# Altium project PCB_Project_1.PrjPcb
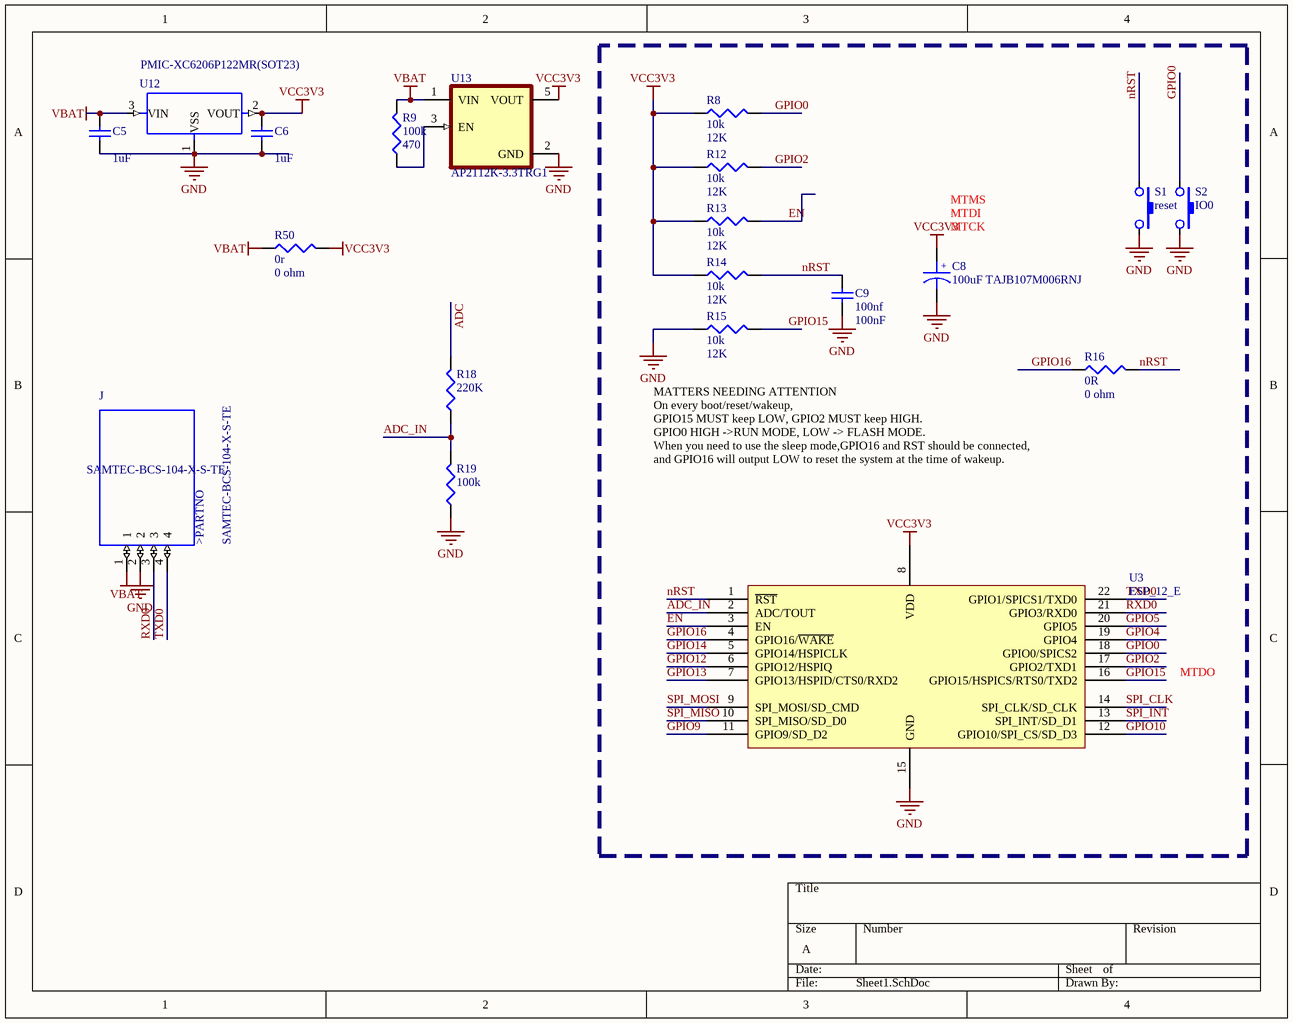
[diagram p0: Sheet1.SchDoc]
2 sheets, 37 parts. Net scope: global (net labels, ports and power ports of the same name join across sheets).
Board files: PCB1.PcbDoc, PCB2.PcbDoc
Sheets:
  Sheet1.SchDoc
  Sheet2.SchDoc

## Sheet Sheet1.SchDoc
size A

### Parts
(Parts that share a designator on the sheet are numbered #1, #2 ... from top to bottom, then left to right.)
C5  value 1uF  [1608[0603]]
C6  value 1uF  [1608[0603]]
C8  100uF TAJB107M006RNJ  [SMT_C_Tantalum_B]
C9  100nf  [1608[0603]]
J  SAMTEC-BCS-104-X-S-TE  [SAMTEC-BCS-104-X-S-TE]
R8  10k  value 12K  [J1-0603]
R9  100k  value 470  [J1-0603]
R12  10k  value 12K  [J1-0603]
R13  10k  value 12K  [J1-0603]
R14  10k  value 12K  [J1-0603]
R15  10k  value 12K  [J1-0603]
R16  0R  value 0 ohm  [J1-0603]
R18  220K  [J1-0603]
R19#1  100k  [J1-0603]
R50  0r  value 0 ohm  [J1-0603]
S1  reset  [SMT_SW_PTS_820]
S2  IO0  [SMT_SW_PTS_820]
U3  ESP_12_E  [ESP_12_E_L]
U12  PMIC-XC6206P122MR(SOT23)  [SOT-23]
U13  AP2112K-3.3TRG1  [SOT95P285X140-5N]

### Nets
GND: C5.1 C6.1 C8.2 C9.1 J.2 R15.1 R19#1.1 S1.2 S2.2 U3.15(GND) U12.1(VSS) U13.2(GND)
VBAT: C5.2 J.1 R9.2 R50.1 U12.3(VIN) U13.1(VIN)
VCC3V3: C6.2 C8.1 R8.1 R12.1 R13.1 R14.1 R50.2 U3.8(VDD) U12.2(VOUT) U13.5(VOUT)
ADC: R18.2
ADC_IN: R18.1 R19#1.2 U3.2(ADC/TOUT)
EN: R13.2 U3.3(EN)
GPIO0: R8.2 S2.1 U3.18(GPIO0/SPICS2)
GPIO2: R12.2 U3.17(GPIO2/TXD1)
GPIO4: U3.19(GPIO4)
GPIO5: U3.20(GPIO5)
GPIO9: U3.11(GPIO9/SD_D2)
GPIO10: U3.12(GPIO10/SPI_CS/SD_D3)
GPIO12: U3.6(GPIO12/HSPIQ)
GPIO13: U3.7(GPIO13/HSPID/CTS0/RXD2)
GPIO14: U3.5(GPIO14/HSPICLK)
GPIO15: R15.2 U3.16(GPIO15/HSPICS/RTS0/TXD2)
GPIO16: R16.1 U3.4(GPIO16/~{WAKE})
nRST: C9.2 R14.2 R16.2 S1.1 U3.1(~{RST})
RXD0: J.3 U3.21(GPIO3/RXD0)
SPI_CLK: U3.14(SPI_CLK/SD_CLK)
SPI_INT: U3.13(SPI_INT/SD_D1)
SPI_MISO: U3.10(SPI_MISO/SD_D0)
SPI_MOSI: U3.9(SPI_MOSI/SD_CMD)
TXD0: J.4 U3.22(GPIO1/SPICS1/TXD0)
NetR9_1: R9.1 U13.3(EN)

### Notes on the sheet
- (near C8) MTCK
- (near C8) MTDI
- MTMS
- (near R16) MATTERS NEEDING ATTENTION
  On every boot/reset/wakeup,
  GPIO15 MUST keep LOW, GPIO2 MUST keep HIGH.
  GPIO0 HIGH ->RUN MODE, LOW -> FLASH MODE.
  When you need to use the sleep mode,GPIO16 and RST should be connected,
  and GPIO16 will output LOW to reset the system at the time of wakeup.
- MTDO
- (in symbol SAMTEC-BCS-104-X-S-TE) >PARTNO
- (in symbol SMT_C_Tantalum_B) +

### Library data of the parts
C5 C6 C9 = Cap Semi: Capacitor (Semiconductor SIM Model); Published: 8-Jun-2000; LatestRevisionDate: 29-May-2009; LatestRevisionNote: IPC-7351 Footprint Added.; PackageReference: C1206; Publisher: Altium Limited; PackageDescription: Chip Capacitor
  C9: Value: 100nF
C8 = SMT_C_Tantalum_B: Capacitor, SM Tantalum; Body 3.5 x 2.8 mm (LxW typ)
J = SAMTEC-BCS-104-X-S-TE: 4 Position Receptacle Connector Through Hole; MP: BCS-104-LM-S-TE; MF: Samtec; Price: None; Value: *; Package: None; SnapEDA_Link: https://www.snapeda.com/parts/BCS-104-LM-S-TE/Samtec/view-part/3331485/?ref=snap; Availability: Unavailable
R8 R9 R12-R16 R18 R19#1 R50 = Res3: Resistor; Published: 8-Jun-2000; LatestRevisionDate: 29-May-2009; LatestRevisionNote: IPC-7351 Footprint Added.; PackageReference: J1-0603; Publisher: Altium Limited; PackageDescription: Chip Resistor
S1 S2 = SMT_SW_PTS_820: SMT Tactile ‎Switch PTS 820 Series
U3 = ESP_12_E: ESP-12 Wi-Fi Module by AI-Thinker; IC: ESP8266-EX; Vendor: Ai-thinker
U12 = PMIC-XC6206P122MR(SOT23): Linear Voltage Regulator IC Output; MF: Torex; Value: *; Package: None; Price: None; MP: XC6206P122MR; Availability: Unavailable; SnapEDA_Link: https://www.snapeda.com/parts/XC6206P122MR/Torex/view-part/105791/?ref=snap
U13 = AP2112K-3.3TRG1: Linear Voltage Regulator IC 1 Output 600mA SOT-25; MF: Diodes Inc.; Digi-Key_Part_Number: AP2112K-3.3TRG1DICT-ND; SnapEDA_Link: https://www.snapeda.com/parts/AP2112K-3.3TRG1/Diodes%20Inc./view-part/454988/?ref=snap; Package: SOT-753 Diodes Inc.; MP: AP2112K-3.3TRG1; Value: *; Digi-Key_Purchase_URL: https://www.digikey.com.au/product-detail/en/diodes-incorporated/AP2112K-3.3TRG1/AP2112K-3.3TRG1DICT-ND/4505257?utm_source=snapeda&utm_medium=aggregator&utm_campaign=symbol

## Sheet Sheet2.SchDoc
size A
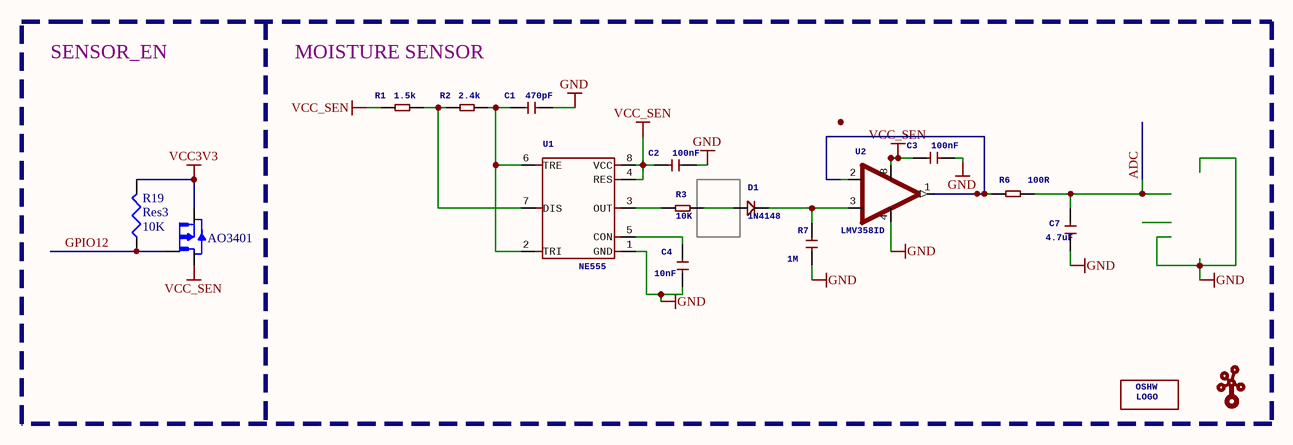
[diagram p1: Sheet2.SchDoc]

### Parts
(Parts that share a designator on the sheet are numbered #1, #2 ... from top to bottom, then left to right.)
C1  470pF  [C0603]
C2  100nF  [C0603]
C3  100nF  [C0603]
C4  10nF  [C0603]
C7  4.7uF  [C0603]
D1  1N4148  [LL-34]
LOGO1  LOGO-OSHW-FILLX0200-NT  [OSHW_FILLX200_NOTEXT]  (value not drawn)
R1  1.5k  [R0603]
R2  2.4k  [R0603]
R3  10K  [R0603]
R6  100R  [R0603]
R7  1M  [C0603]
R19#2  Res3  value 10K  [J1-0603]
U1  NE555  [SOIC8-1.27-5X4MM]
U2  LMV358ID  [SOIC8-1.27-5X4MM]
U$7  LOGO-GROVE  [GROVE-SILK-BIG]  (value not drawn)
  AO3401  [SOT23]

### Nets
GND: C1.1 C2.1 C3.1 C4.2 C7.2 R7.2 U1.1(GND) U2.4(GND)
VCC3V3: R19#2.2 .2(S)
VCC_SEN: C2.2 C3.2 R1.2 U1.4(RES) U1.8(VCC) U2.8(+V) .3(D)
ADC: C7.1 R6.2
GPIO12: R19#2.1 .1(G)
NetC1_2: C1.2 R2.1 U1.2(TRI) U1.6(TRE)
NetC4_1: C4.1 U1.5(CON)
NetD1_A: D1.A(+) R3.2
NetD1_C: D1.C(-) R7.1 U2.3(+IN1)
NetR1_1: R1.1 R2.2 U1.7(DIS)
NetR3_1: R3.1 U1.3(OUT)
NetR6_1: R6.1 U2.1(OUT1) U2.2(-IN1)

### Notes on the sheet
- SENSOR_EN
- MOISTURE SENSOR

### Library data of the parts
C1-C4 C7 R7 = CAP-0603: Ceramic Capacitors
D1 = DIODE*'1N4148-SMD'
LOGO1 = LOGO-OSHW-FILLX0200-NT: PARTNO: DNP; OSHW: OSHW; LOGO: LOGO
R1-R3 R6 = RES-0603
R19#2 = Res3: Resistor; Published: 8-Jun-2000; LatestRevisionDate: 29-May-2009; LatestRevisionNote: IPC-7351 Footprint Added.; PackageReference: J1-0603; Publisher: Altium Limited; PackageDescription: Chip Resistor
U1 = CLOCK/TIMING-NE555'DR': DIP-8:310110001;SOIC-8:310110013;TSSOP-8:310110002
U2 = AMPLIFIER-LMV358'D': SOIC-8:310020002;MSOP-8:310020007
U$7 = LOGO-GROVE: PARTNO: DNP
 = AO3401: P-Channel 30V 4A _Ta_ 1.4W _Ta_ Surface Mount SOT-23-3; MF: Alpha & Omega Semiconductor

## Nets that join several sheets
GND: Sheet1 (12 pins), Sheet2 (8 pins)
VCC3V3: Sheet1 (10 pins), Sheet2 (R19#2.2 .2)
ADC: Sheet1 (R18.2), Sheet2 (C7.1 R6.2)
GPIO12: Sheet1 (U3.6), Sheet2 (R19#2.1 .1)